# Altium schematic sheet Sheet2.SchDoc
size A; SheetNumber: 2; SheetTotal: 2
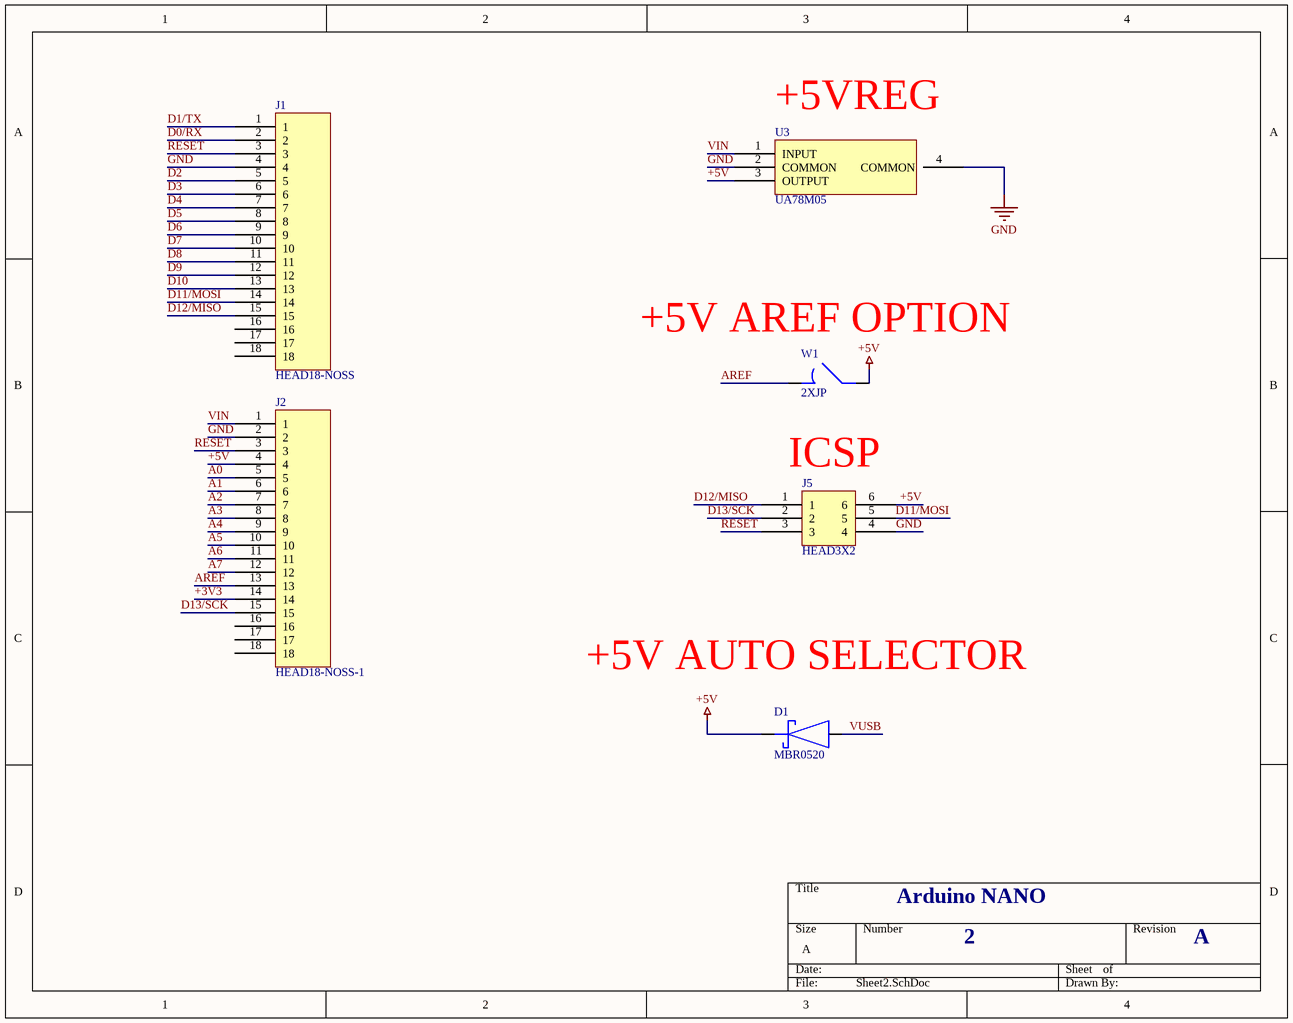
[diagram p0: Sheet2.SchDoc]

## Parts
D1  MBR0520  [Diode]
J1  HEAD18-NOSS  [DIP18]
J2  HEAD18-NOSS-1  [DIP18]
J5  HEAD3X2  [DIP6]
U3  UA78M05  [SOT223-4]
W1  2XJP  [PUSH BUTTON]

## Nets
+5V: D1.1 J2.4 J5.6 U3.3(OUTPUT) W1.2
GND: J1.4 J2.2 J5.4 U3.2(COMMON) U3.4(COMMON)
+3V3: J2.14
A0: J2.5
A1: J2.6
A2: J2.7
A3: J2.8
A4: J2.9
A5: J2.10
A6: J2.11
A7: J2.12
AREF: J2.13 W1.1
D0/RX: J1.2
D1/TX: J1.1
D2: J1.5
D3: J1.6
D4: J1.7
D5: J1.8
D6: J1.9
D7: J1.10
D8: J1.11
D9: J1.12
D10: J1.13
D11/MOSI: J1.14 J5.5
D12/MISO: J1.15 J5.1
D13/SCK: J2.15 J5.2
RESET: J1.3 J2.3 J5.3
VIN: J2.1 U3.1(INPUT)
VUSB: D1.2

Not connected (* = marked no-connect by the designer): J1 16 17 18; J2 16 17 18

## Notes on the sheet
- (near U3) +5VREG
- (near W1) +5V AREF OPTION
- (near J5) ICSP
- +5V AUTO SELECTOR
- Arduino NANO
- 2
- A

## Library data of the parts
D1 = PMEG2005AESFYL: DIODE SCHOTTKY 20V 0.5A SOD962; Manufacturer: Nexperia; Supplier: Digikey; Supplier Part Number: 1727-2287-1-ND; Manufacturer Part Number: PMEG2005AESFYL; RoHS: Yes; Category: Schottky Diodes; Stock: 6324; Pricing: 1=0.38, 10=0.264, 100=0.1289, 500=0.1075, 1000=0.07469, 2000=0.06473 (USD); ComponentLink1URL: https://datasheet.octopart.com/PMEG2005AESFYL-Nexperia-datasheet-56972488.pdf?src-supplier=Newark; ComponentLink1Description: https://datasheet.octopart.com/PMEG2005AESFYL-Nexperia-datasheet-56972488.pdf?src-supplier=Newark; ComponentLink2URL: https://datasheet.octopart.com/PMEG2005AESFYL-Nexperia-datasheet-87844667.pdf?src-supplier=Future+Electronics; ComponentLink2Description: https://datasheet.octopart.com/PMEG2005AESFYL-Nexperia-datasheet-87844667.pdf?src-supplier=Future+Electronics; ComponentLink3URL: http://datasheet.octopart.com/PMEG2005AESFYL-Nexperia-datasheet-87844667.pdf?src-supplier=Mouser; ComponentLink3Description: http://datasheet.octopart.com/PMEG2005AESFYL-Nexperia-datasheet-87844667.pdf?src-supplier=Mouser; ComponentLink4URL: http://datasheet.octopart.com/PMEG2005AESFYL-Nexperia-datasheet-87844667.pdf?src-supplier=Avnet; ComponentLink4Description: http://datasheet.octopart.com/PMEG2005AESFYL-Nexperia-datasheet-87844667.pdf?src-supplier=Avnet; ComponentLink5URL: http://datasheet.octopart.com/PMEG2005AESFYL-Nexperia-datasheet-87844667.pdf?src-supplier=Farnell; ComponentLink5Description: http://datasheet.octopart.com/PMEG2005AESFYL-Nexperia-datasheet-87844667.pdf?src-supplier=Farnell; ComponentLink6URL: http://datasheet.octopart.com/PMEG2005AESFYL-Nexperia-datasheet-87844667.pdf?src-supplier=Digikey; ComponentLink6Description: http://datasheet.octopart.com/PMEG2005AESFYL-Nexperia-datasheet-87844667.pdf?src-supplier=Digikey; ComponentLink7URL: https://assets.nexperia.com/documents/data-sheet/PMEG2005AESF.pdf?src-supplier=Digikey; ComponentLink7Description: https://assets.nexperia.com/documents/data-sheet/PMEG2005AESF.pdf?src-supplier=Digikey; ComponentLink8URL: http://datasheet.octopart.com/PMEG2005AESFYL-Nexperia-datasheet-87844667.pdf?src-supplier=Verical; ComponentLink8Description: http://datasheet.octopart.com/PMEG2005AESFYL-Nexperia-datasheet-87844667.pdf?src-supplier=Verical; ComponentLink9URL: http://datasheet.octopart.com/PMEG2005AESFYL-Nexperia-datasheet-87844667.pdf?src-supplier=Rochester+Electronics; ComponentLink9Description: http://datasheet.octopart.com/PMEG2005AESFYL-Nexperia-datasheet-87844667.pdf?src-supplier=Rochester+Electronics; ComponentLink10URL: http://datasheet.octopart.com/PMEG2005AESFYL-Nexperia-datasheet-87844667.pdf?src-supplier=TTI; ComponentLink10Description: http://datasheet.octopart.com/PMEG2005AESFYL-Nexperia-datasheet-87844667.pdf?src-supplier=TTI
J1 J2 = 951140-8622-AR: Pin Strip Header, 951 Series, 9511408622AR | 3M 951140-8622-AR; Supplier: Digikey; Supplier Part Number: 3M156413-02-ND; Manufacturer: 3M; Manufacturer Part Number: 951140-8622-AR; RoHS: Yes; Category: Connectors; Stock: 16596; Pricing: 1=0.25, 10=0.214, 100=0.1644, 500=0.13914, 1000=0.11384, 5000=0.10119, 10000=0.09171 (USD); ComponentLink1URL: https://datasheet.ciiva.com/730/ts2156-730447.pdf?src-supplier=Digikey; ComponentLink1Description: https://datasheet.ciiva.com/730/ts2156-730447.pdf?src-supplier=Digikey; ComponentLink2URL: https://datasheet.ciiva.com/7997/ts2156-7997245.pdf?src-supplier=Element14; ComponentLink2Description: https://datasheet.ciiva.com/7997/ts2156-7997245.pdf?src-supplier=Element14
J5 = 929836-09-03-RK: 80000908477  929836-09-03-RK=6/.100/STR/HDR/2R/.23; Manufacturer: 3M; Supplier: Digikey; Supplier Part Number: 3M156508-06-ND; Manufacturer Part Number: 929836-09-03-RK; RoHS: Yes; Category: Headers and Wire Housings; Stock: 680; Pricing: 1=0.57, 10=0.495, 100=0.4082, 500=0.35492, 1000=0.2928, 5000=0.25731, 10000=0.23957 (USD); ComponentLink1URL: https://datasheet.ciiva.com/15395/ts0769-15395497.pdf?src-supplier=Mouser; ComponentLink1Description: https://datasheet.ciiva.com/15395/ts0769-15395497.pdf?src-supplier=Mouser
U3 = UA78M05CDCYRG3: 500-mA, 30-V, linear voltage regulator 4-SOT-223 0 to 125; Manufacturer: Texas Instruments; Output Voltage: 5V; Dropout Voltage: 2V; Number of Outputs: 1; Min Input Voltage: 7V; Max Supply Voltage: 25V; Max Output current: 500mA; Polarity: Positive; Power Supply Rejection Ratio (PSRR): 80dB; Quiescent Current: 4.5mA; Output Type: Fixed; Supplier: Digikey; Supplier Part Number: 296-50456-1-ND; Manufacturer Part Number: UA78M05CDCYRG3; RoHS: Yes; Category: Voltage Regulators - Linear; Stock: 4233; Pricing: 1=0.76, 10=0.667, 25=0.6264, 100=0.5111, 250=0.47472, 500=0.404, 1000=0.3232 (USD); Mounting Technology: Surface Mount; Case/Package: SOT-223-4; Pins: 4; Weight: 0.006632oz; Min Operating Temperature: -40°C; Max Operating Temperature: 125°C; Package Quantity: 2500; Packaging: Tape and Reel; Output Current: 500mA; Number of Regulators: 1; Series: UA78M05; Lead Free: Lead Free; RoHS Compliant: Yes; ComponentLink1URL: https://datasheet.ciiva.com/2060/ua78m05-2060145.pdf?src-supplier=Digikey; ComponentLink1Description: https://datasheet.ciiva.com/2060/ua78m05-2060145.pdf?src-supplier=Digikey
W1 = B3U-1000P: Switch Tactile N.O. SPST Round Button Gull Wing 0.05A 12VDC 1.5N SMD Embossed T/R; Manufacturer: Omron; Mechanical Life: 200000Cycles; Contact Current Rating: 50mA; Voltage Rating (DC): 12V; Contact Resistance: 100mR; Illumination Type: Non-Illuminated,Illuminated; Switch Travel: 0.15mm; Switch Function: Off-Mom; Actuator Type: Standard; Number of Positions: 2NUMBER; Actuator Length: 0.4mm; Ratings: Dust Proof,IP40; Supplier: Digikey; Supplier Part Number: SW1020CT-ND; Manufacturer Part Number: B3U-1000P; RoHS: Yes; Category: Tactile Switches; Stock: 4470; Pricing: 1=1.02, 10=0.983, 25=0.9188, 100=0.7977, 250=0.72584, 500=0.67292, 1000=0.62377 (USD); Mounting Technology: Surface Mount; Pins: 2NUMBER; Contact Material: Silver; Weight: 0.000776oz; Color: 56Colour; Min Operating Temperature: -25°C; Max Operating Temperature: 70°C; Operating Force: 1.5N; Max Current Rating: 50mA; Packaging: Tape and Reel; Throw Configuration: SPST; Package Quantity: 1; Max Voltage Rating (DC): 12V; Current Rating: 50mA; Termination: SMD/SMT; Electrical Life: 200000Cycles; Insulation Resistance: 100MR; Orientation: Straight; Series: B3U; Length: 4mm; Width: 3mm; Height: 1.2mm; Depth: 2.5mm; RoHS Compliant: Yes; Reach SVHC Compliant: Unknown; Lead Free: 5697LeadFree; ComponentLink1URL: https://datasheet.ciiva.com/22696/1685550-22696214.pdf?src-supplier=Element14; ComponentLink1Description: https://datasheet.ciiva.com/22696/1685550-22696214.pdf?src-supplier=Element14; ComponentLink2URL: https://datasheet.ciiva.com/1532/1685550-1532680.pdf?src-supplier=Element14; ComponentLink2Description: https://datasheet.ciiva.com/1532/1685550-1532680.pdf?src-supplier=Element14; ComponentLink3URL: https://datasheet.ciiva.com/1634/1685550-1634396.pdf?src-supplier=Farnell; ComponentLink3Description: https://datasheet.ciiva.com/1634/1685550-1634396.pdf?src-supplier=Farnell; ComponentLink4URL: https://datasheet.ciiva.com/16862/70176037-16862846.pdf?src-supplier=Allied+Electronics; ComponentLink4Description: https://datasheet.ciiva.com/16862/70176037-16862846.pdf?src-supplier=Allied+Electronics